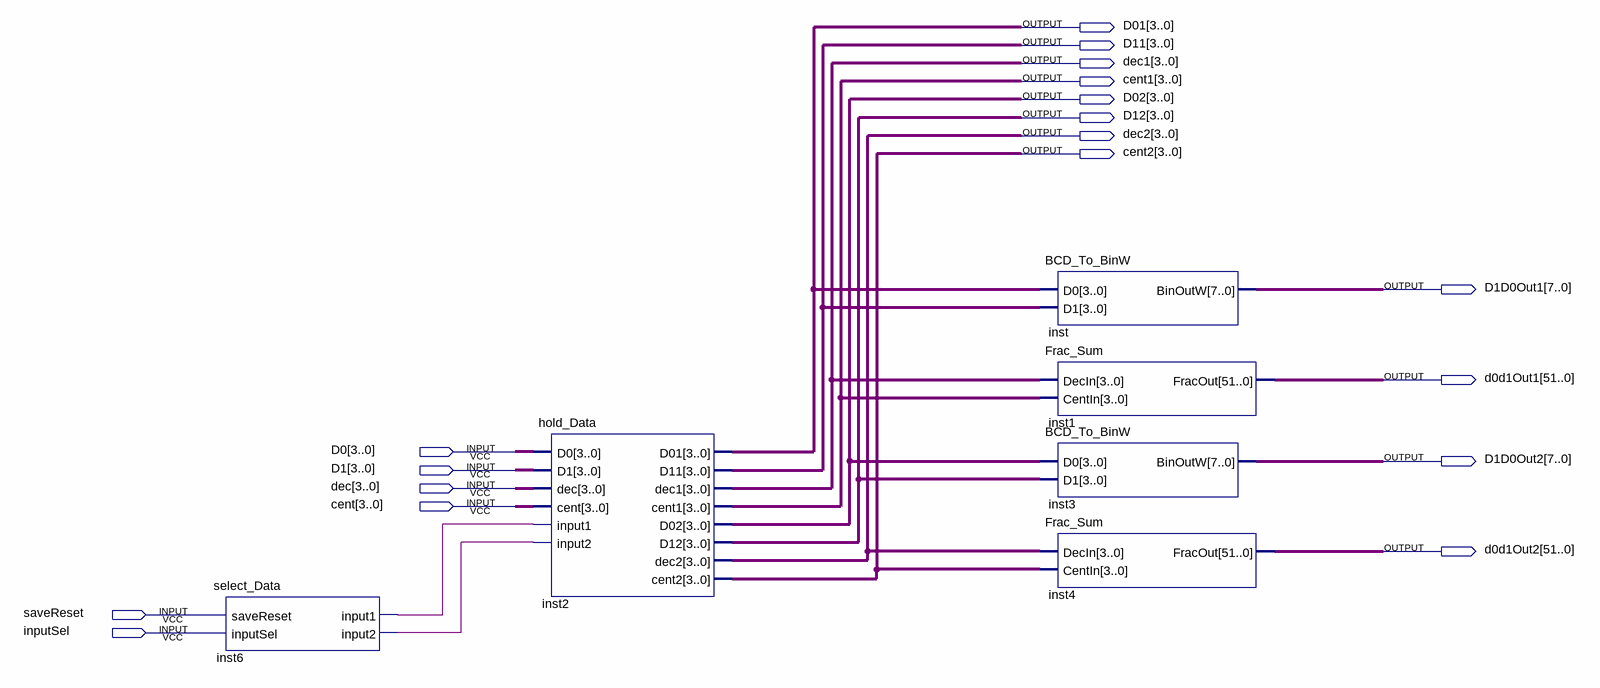
[diagram p0: schematic sheet]
// Quartus schematic Input.bdf as structural Verilog: 6 symbols, 18 pins
module Input (
  input  [3:0] D0,
  input  [3:0] D1,
  input  [3:0] dec,
  input  [3:0] cent,
  input  saveReset,
  input  inputSel,
  output [3:0] D01,
  output [3:0] D11,
  output [3:0] dec1,
  output [3:0] cent1,
  output [3:0] D02,
  output [3:0] D12,
  output [3:0] dec2,
  output [3:0] cent2,
  output [7:0] D1D0Out1,
  output [51:0] d0d1Out1,
  output [7:0] D1D0Out2,
  output [51:0] d0d1Out2
);

  wire inst6_input1, inst6_input2;

  select_Data inst6 (.saveReset(saveReset), .inputSel(inputSel), .input1(inst6_input1), .input2(inst6_input2));
  hold_Data inst2 (
    .D0(D0), .D1(D1), .dec(dec), .cent(cent), .input1(inst6_input1), .input2(inst6_input2), .D01(D01),
    .D11(D11), .dec1(dec1), .cent1(cent1), .D02(D02), .D12(D12), .dec2(dec2), .cent2(cent2));
  BCD_To_BinW inst (.D0(D01), .D1(D11), .BinOutW(D1D0Out1));
  Frac_Sum inst1 (.DecIn(dec1), .CentIn(cent1), .FracOut(d0d1Out1));
  BCD_To_BinW inst3 (.D0(D02), .D1(D12), .BinOutW(D1D0Out2));
  Frac_Sum inst4 (.DecIn(dec2), .CentIn(cent2), .FracOut(d0d1Out2));
endmodule
